# Altium schematic sheet GPSSchematic.SchDoc
size A3
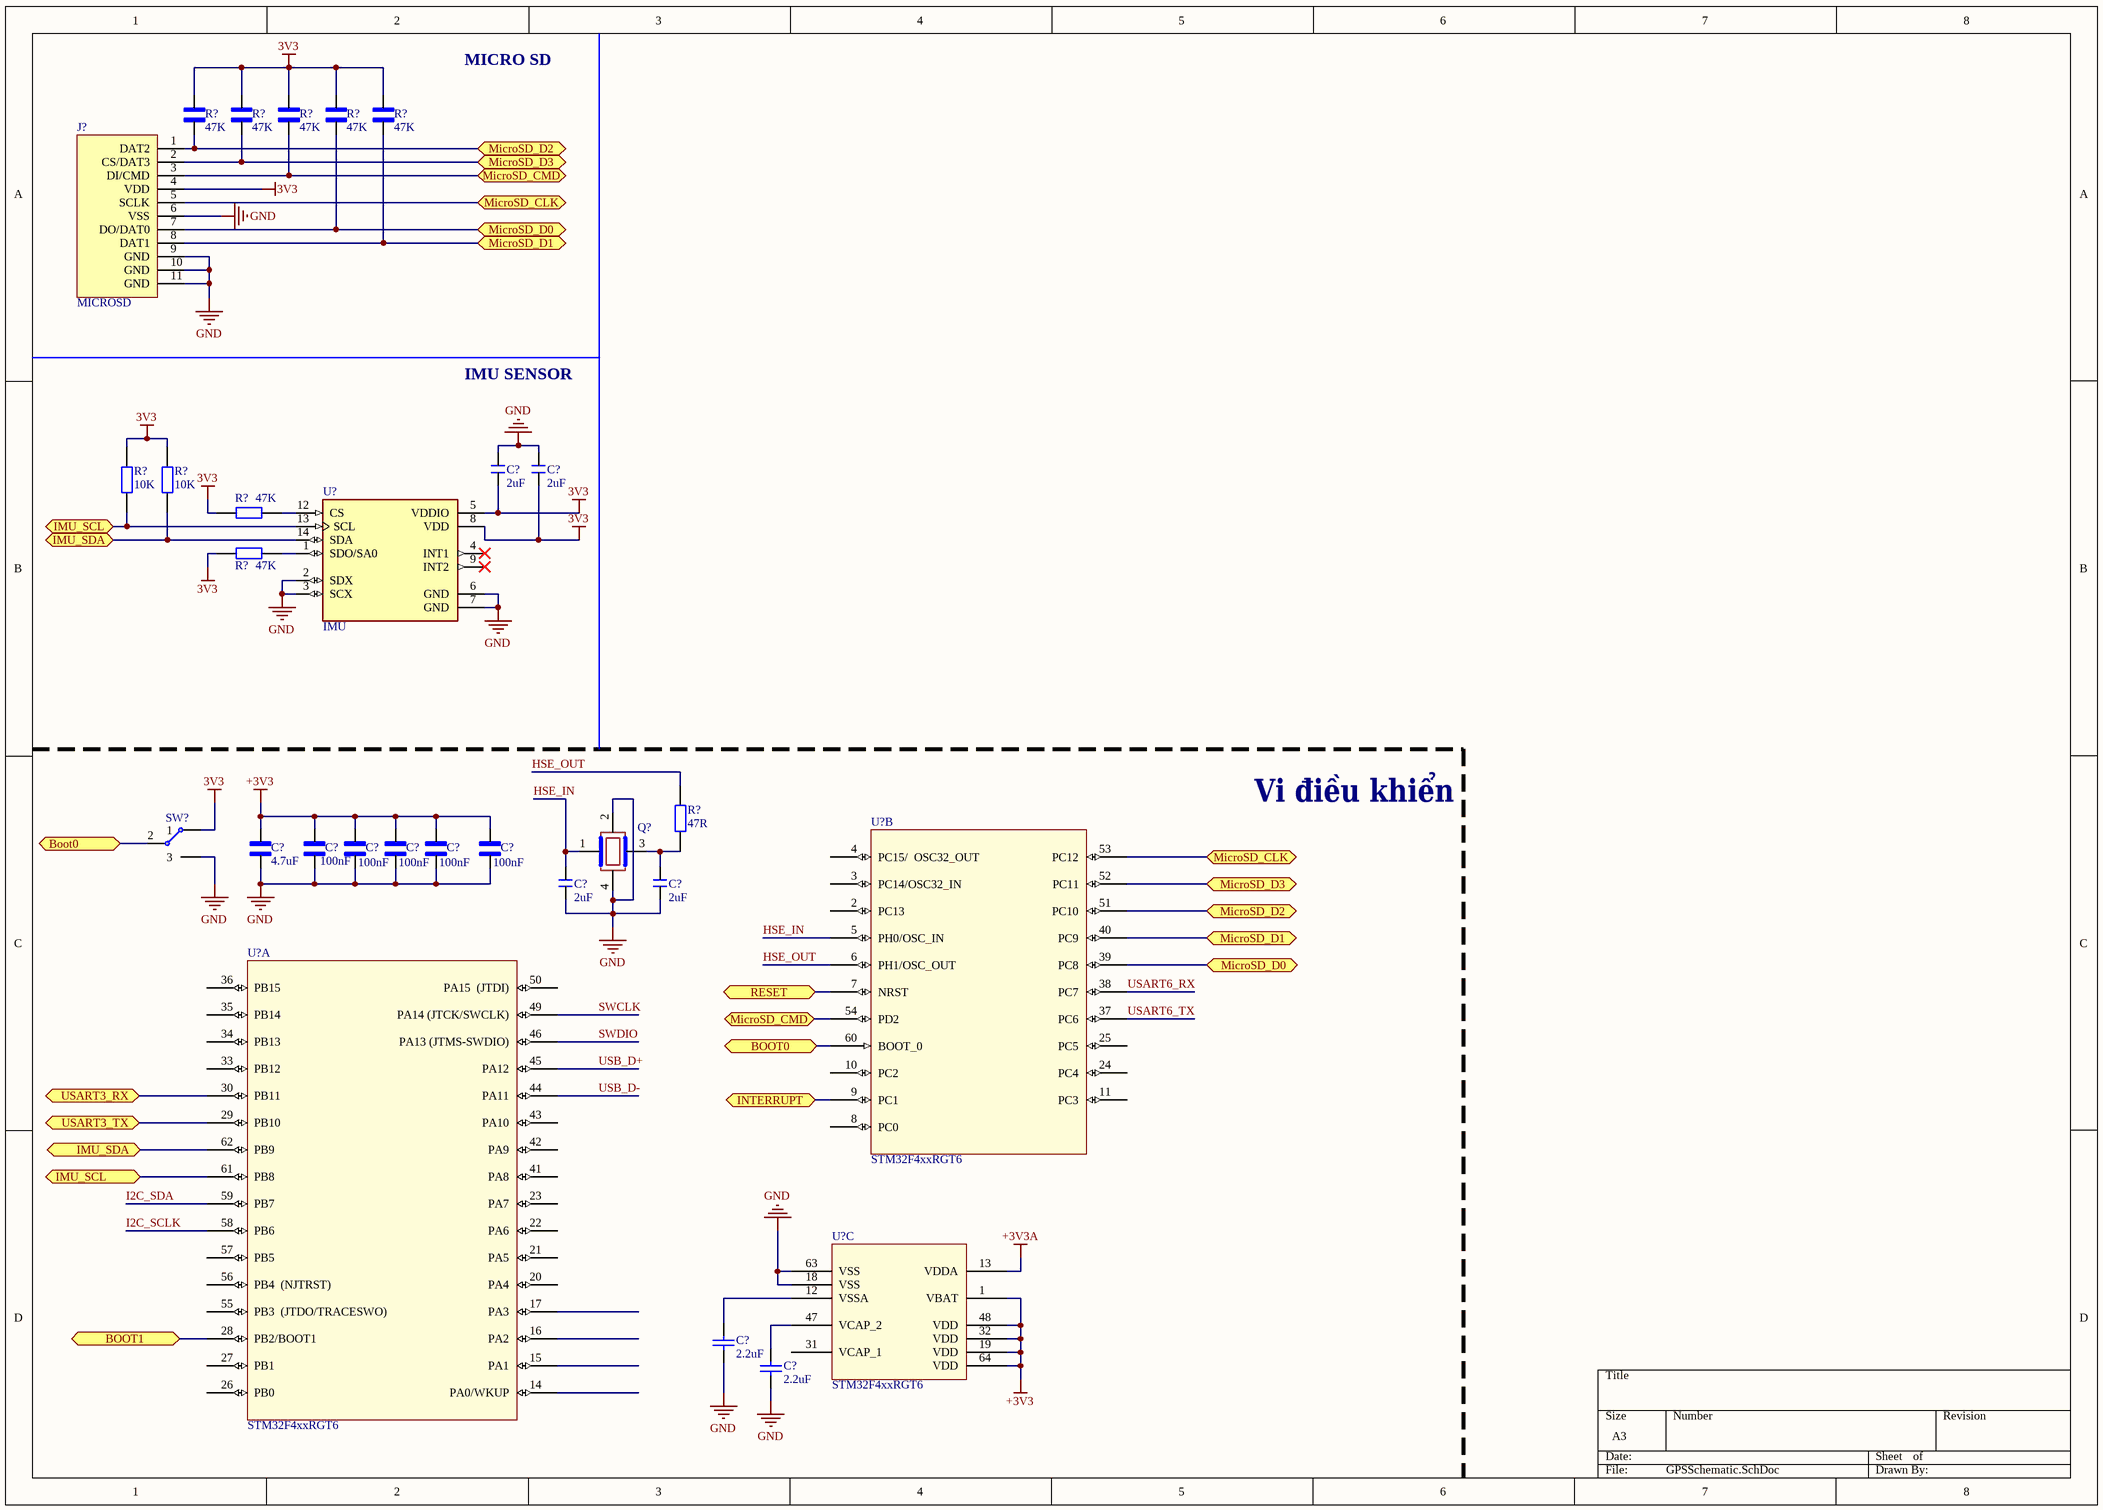
[diagram p0: GPSSchematic.SchDoc]

## Parts
(Parts that share a designator on the sheet are numbered #1, #2 ... from top to bottom, then left to right.)
C?#1  2uF  [CAPC 4.7uF 0603]
C?#2  2uF  [CAPC 4.7uF 0603]
C?#3  100nF  [CAP 0402]
C?#4  100nF  [CAP 0402]
C?#5  100nF  [CAP 0402]
C?#6  100nF  [CAP 0402]
C?#7  100nF  [CAP 0402]
C?#8  4.7uF  [CAPC 4.7uF 0603]
C?#9  2uF
C?#10  2uF
C?#11  2.2uF  [CAP 0402]
C?#12  2.2uF  [CAP 0402]
J?  MICROSD  [MICROSD]
Q?  CRYSTAL2  (value not drawn)
R?#1  47K  [RES 0402]
R?#2  47K  [RES 0402]
R?#3  47K  [RES 0402]
R?#4  47K  [RES 0402]
R?#5  47K  [RES 0402]
R?#6  10K  [RES 0603 47R]
R?#7  10K  [RES 0603 47R]
R?#8  47K  [RES 0603 47R]
R?#9  47K  [RES 0603 47R]
R?#10  47R  [RES 0603 47R]
SW?  Switch_Slide 3 Port  [Switch 4mm]  (value not drawn)
U?#1  IMU  [IMU]
U?#2  STM32F4xxRGT6  (part B of 3)
U?#3  STM32F4xxRGT6  (part A of 3)
U?#4  STM32F4xxRGT6  (part C of 3)

## Ports
BOOT0, Boot0, BOOT1, IMU_SCL, IMU_SDA, INTERRUPT, MicroSD_CLK, MicroSD_CMD, MicroSD_D0, MicroSD_D1, MicroSD_D2, MicroSD_D3, RESET, USART3_RX, USART3_TX

## Nets
3V3: C?#1.?1 C?#2.?1 J?.4(VDD) R?#1.1 R?#2.1 R?#3.1 R?#4.1 R?#5.1 R?#6.2 R?#7.2 R?#8.1 R?#9.1 SW?.1 U?#1.5(VDDIO) U?#1.8(VDD)
+3V3: C?#3.2 C?#4.2 C?#5.2 C?#6.2 C?#7.2 C?#8.2 U?#4.1(VBAT) U?#4.19(VDD) U?#4.32(VDD) U?#4.48(VDD) U?#4.64(VDD)
+3V3A: U?#4.13(VDDA)
GND: C?#1.?2 C?#2.?2 C?#3.1 C?#4.1 C?#5.1 C?#6.1 C?#7.1 C?#8.1 C?#9.?1 C?#10.?1 C?#11.1 C?#12.1 J?.6(VSS) J?.9(GND) J?.10(GND) J?.11(GND) Q?.2 Q?.4 SW?.3 U?#1.2(SDX) U?#1.3(SCX) U?#1.6(GND) U?#1.7(GND) U?#4.18(VSS) U?#4.63(VSS)
BOOT0: SW?.2 U?#2.60(BOOT_0) ; port BOOT0, port Boot0
BOOT1: U?#3.28(PB2/BOOT1) ; port BOOT1
HSE_IN: C?#9.?2 Q?.1 U?#2.5(PH0/OSC_IN)
HSE_OUT: R?#10.2 U?#2.6(PH1/OSC_OUT)
I2C_SCLK: U?#3.58(PB6)
I2C_SDA: U?#3.59(PB7)
IMU_SCL: R?#6.1 U?#1.13(SCL) U?#3.61(PB8) ; port IMU_SCL
IMU_SDA: R?#7.1 U?#1.14(SDA) U?#3.62(PB9) ; port IMU_SDA
INTERRUPT: U?#2.9(PC1) ; port INTERRUPT
MicroSD_CLK: J?.5(SCLK) U?#2.53(PC12) ; port MicroSD_CLK
MicroSD_CMD: J?.3(DI/CMD) R?#3.2 U?#2.54(PD2) ; port MicroSD_CMD
MicroSD_D0: J?.7(DO/DAT0) R?#4.2 U?#2.39(PC8) ; port MicroSD_D0
MicroSD_D1: J?.8(DAT1) R?#5.2 U?#2.40(PC9) ; port MicroSD_D1
MicroSD_D2: J?.1(DAT2) R?#1.2 U?#2.51(PC10) ; port MicroSD_D2
MicroSD_D3: J?.2(CS/DAT3) R?#2.2 U?#2.52(PC11) ; port MicroSD_D3
RESET: U?#2.7(NRST) ; port RESET
SWCLK: U?#3.49(PA14_(JTCK/SWCLK))
SWDIO: U?#3.46(PA13_(JTMS-SWDIO))
USART3_RX: U?#3.30(PB11) ; port USART3_RX
USART3_TX: U?#3.29(PB10) ; port USART3_TX
USART6_RX: U?#2.38(PC7)
USART6_TX: U?#2.37(PC6)
USB_D+: U?#3.45(PA12)
USB_D-: U?#3.44(PA11)
NetC?#10_?2: C?#10.?2 Q?.3 R?#10.1
NetC?#11_2: C?#11.2 U?#4.12(VSSA)
NetC?#12_2: C?#12.2 U?#4.47(VCAP_2)
NetR?#8_2: R?#8.2 U?#1.12(CS)
NetR?#9_2: R?#9.2 U?#1.1(SDO/SA0)

Not connected (* = marked no-connect by the designer): U?#1 4(INT1)* 9(INT2)*; U?#2 2(PC13) 3(PC14/OSC32_IN) 4(PC15/__OSC32_OUT) 8(PC0) 10(PC2) 11(PC3) 24(PC4) 25(PC5); U?#3 14(PA0/WKUP) 15(PA1) 16(PA2) 17(PA3) 20(PA4) 21(PA5) 22(PA6) 23(PA7) 26(PB0) 27(PB1) 33(PB12) 34(PB13) 35(PB14) 36(PB15) 41(PA8) 42(PA9) 43(PA10) 50(PA15__(JTDI)) 55(PB3__(JTDO/TRACESWO)) 56(PB4__(NJTRST)) 57(PB5); U?#4 31(VCAP_1)

## Notes on the sheet
- MICRO SD
- IMU SENSOR
- Vi điều khiển

## Library data of the parts
C?#1 C?#2 C?#9 C?#10 = Cap 2uf 0603
C?#3-C?#7 = CAP 100nF
C?#8 = CAP 4.7uF: MP: GRM188C71C475KE21D; Package: None; Price: None; Value: *; Availability: Unavailable
C?#11 C?#12 = CAP 0402
R?#1-R?#5 = RES 0402: 1 kOhms Â±1% 0.1W, 1/10W Chip Resistor 0402 _1005 Metric_ Anti-Sulfur Thin Film; MP: S-0402; MF: Johanson; Price: None; Package: 0402 Johanson; Value: *; Availability: Unavailable; SnapEDA_Link: https://www.snapeda.com/parts/S-0402/Johanson/view-part/4220759/?ref=snap
R?#6-R?#10 = RES 47R 0603
SW? = Switch_Slide 3 Port: Manu numb: OS102011MS2QN1
U?#1 = IMU: Accelerometer, Gyroscope, Temperature, 6 Axis Sensor IÂ²C, SPI Output; MP: LSM6DSLTR; MF: STMicroelectronics; SnapEDA_Link: https://www.snapeda.com/parts/LSM6DSLTR/STMicroelectronics/view-part/550517/?ref=snap; Availability: Unavailable; Value: *; Price: None; Package: LGA-14 STMicroelectronics